# EAGLE design bq25570_board_large (EAGLE 7.2.0)
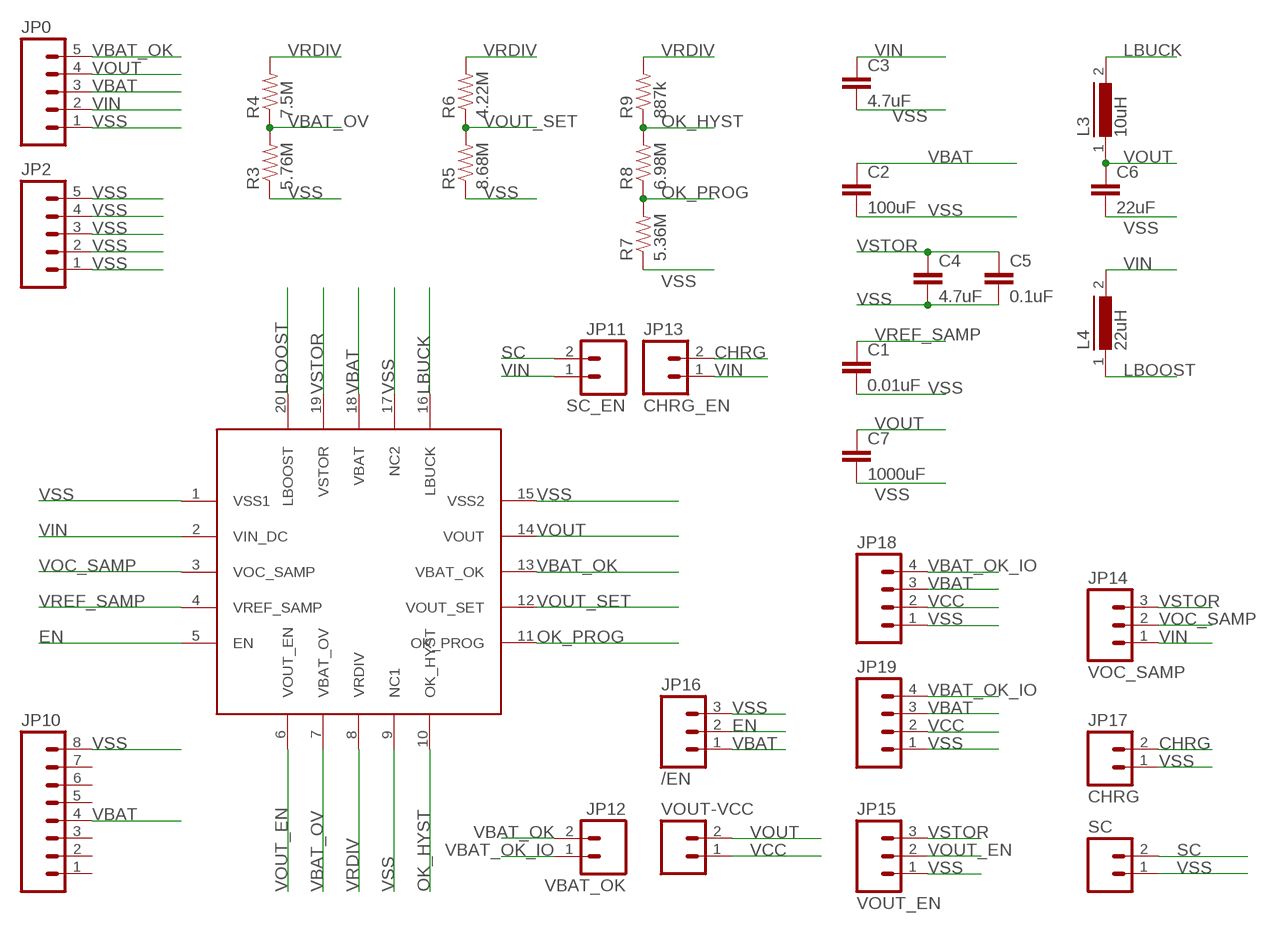
[diagram p0: schematic, sheet 1]

## Parts
C1  0.01uF  CAPEZ  [CAP-PTH-SMALLEZ]
C2  100uF  CAPEZ  [CAP-PTH-SMALLEZ]
C3  4.7uF  CAPEZ  [CAP-PTH-SMALLEZ]
C4  4.7uF  CAPEZ  [CAP-PTH-SMALLEZ]
C5  0.1uF  CAPEZ  [CAP-PTH-SMALLEZ]
C6  22uF  CAPEZ  [CAP-PTH-SMALLEZ]
C7  1000uF  CAPEZ  [CAP-PTH-SMALLEZ]
JP0  M05PTH  [1X05]
JP2  M05PTH  [1X05]
JP10  M08  [1X08_ROUND]
JP11  SC_EN  M02PTH  [1X02]
JP12  VBAT_OK  M02PTH  [1X02]
JP13  CHRG_EN  M02PTH  [1X02]
JP14  VOC_SAMP  M03PTH  [1X03]
JP15  VOUT_EN  M03PTH  [1X03]
JP16  /EN  M03PTH  [1X03]
JP17  CHRG  M02PTH  [1X02]
JP18  M04PTH  [1X04]
JP19  M04PTH  [1X04]
L3  10uH  BC12  [BC12]
L4  22uH  BC12  [BC12]
R3  5.76M  1KOHM-1/4W-1%(PTH)  [AXIAL-0.3]
R4  7.5M  1KOHM-1/4W-1%(PTH)  [AXIAL-0.3]
R5  8.68M  1KOHM-1/4W-1%(PTH)  [AXIAL-0.3]
R6  4.22M  1KOHM-1/4W-1%(PTH)  [AXIAL-0.3]
R7  5.36M  1KOHM-1/4W-1%(PTH)  [AXIAL-0.3]
R8  6.98M  1KOHM-1/4W-1%(PTH)  [AXIAL-0.3]
R9  887k  1KOHM-1/4W-1%(PTH)  [AXIAL-0.3]
SC  M02PTH  [1X02]
SV2  BQ25570_BOARD  [MA05-1]
VOUT-VCC  M02PTH  [1X02]

## Nets
CHRG: JP13.2 JP17.2
EN: JP16.2 SV2.5(EN)
LBOOST: L4.1 SV2.20(LBOOST)
LBUCK: L3.2 SV2.16(LBUCK)
OK_HYST: R8.P$2 R9.P$1 SV2.10(OK_HYST)
OK_PROG: R7.P$2 R8.P$1 SV2.11(OK_PROG)
SC: JP11.2 SC.2
VBAT: C2.1 JP0.3 JP10.4 JP16.1 JP18.3 JP19.3 SV2.18(VBAT)
VBAT_OK: JP0.5 JP12.2 SV2.13(VBAT_OK)
VBAT_OK_IO: JP12.1 JP18.4 JP19.4
VBAT_OV: R3.P$2 R4.P$1 SV2.7(VBAT_OV)
VCC: JP18.2 JP19.2 VOUT-VCC.1
VIN: C3.1 JP0.2 JP11.1 JP13.1 JP14.1 L4.2 SV2.2(VIN_DC)
VOC_SAMP: JP14.2 SV2.3(VOC_SAMP)
VOUT: C6.1 C7.1 JP0.4 L3.1 SV2.14(VOUT) VOUT-VCC.2
VOUT_EN: JP15.2 SV2.6(VOUT_EN)
VOUT_SET: R5.P$2 R6.P$1 SV2.12(VOUT_SET)
VRDIV: R4.P$2 R6.P$2 R9.P$2 SV2.8(VRDIV)
VREF_SAMP: C1.1 SV2.4(VREF_SAMP)
VSS: C1.2 C2.2 C3.2 C4.2 C5.2 C6.2 C7.2 JP0.1 JP2.1 JP2.2 JP2.3 JP2.4 JP2.5 JP10.8 JP15.1 JP16.3 JP17.1 JP18.1 JP19.1 R3.P$1 R5.P$1 R7.P$1 SC.1 SV2.1(VSS1) SV2.9(NC1) SV2.15(VSS2) SV2.17(NC2)
VSTOR: C4.1 C5.1 JP14.3 JP15.3 SV2.19(VSTOR)
Unconnected: JP10.1 JP10.2 JP10.3 JP10.5 JP10.6 JP10.7

## Library data of the parts
C1-C7 = SparkFun-Capacitors:CAP: Capacitor Standard 0603 ceramic capacitor, and 0.1" leaded capacitor.
JP0 JP2 = SparkFun-Connectors:M05: Header 5 Standard 5-pin 0.1" header. Use with straight break away headers (SKU : PRT-00116), right angle break away headers (PRT-00553), swiss pins (PRT-00743), machine pins (PRT-00117), and female headers (PRT-00115). Molex polarized connector foot print use with SKU : PRT-08230 with associated crimp pins and housings.
JP10 = SparkFun-Connectors:M08: Header 8 Standard 8-pin 0.1" header. Use with straight break away headers (SKU : PRT-00116), right angle break away headers (PRT-00553), swiss pins (PRT-00743), machine pins (PRT-00117), and female headers (PRT-00115).
JP11-JP13 JP17 SC VOUT-VCC = SparkFun-Connectors:M02: Standard 2-pin 0.1" header. Use with - straight break away headers ( PRT-00116) - right angle break away headers (PRT-00553) - swiss pins (PRT-00743) - machine pins (PRT-00117) - female headers (PRT-00115) Molex polarized connector foot print use with: PRT-08233 with associated crimp pins and housings. 2.54_SCREWTERM for use with PRT-10571. 3.5mm Screw Terminal footprints for PRT-08084 5mm Screw Terminal footprints for use with PRT-08432
JP14-JP16 = SparkFun-Connectors:M03: Header 3 Standard 3-pin 0.1" header. Use with straight break away headers (SKU : PRT-00116), right angle break away headers (PRT-00553), swiss pins (PRT-00743), machine pins (PRT-00117), and female headers (PRT-00115). Molex polarized connector foot print use with SKU : PRT-08232 with associated crimp pins and housings.
JP18 JP19 = SparkFun-Connectors:M04: Header 4 Standard 4-pin 0.1" header. Use with straight break away headers (SKU : PRT-00116), right angle break away headers (PRT-00553), swiss pins (PRT-00743), machine pins (PRT-00117), and female headers (PRT-00115). Molex polarized connector foot print use with SKU : PRT-08231 with associated crimp pins and housings. 1MM SMD Version SKU: PRT-10208
L3 L4 = inductors:BC12: INDUCTOR
R3-R9 = SparkFun-Resistors:1KOHM-1/4W-1%(PTH): RES-12182; PROD_ID: RES-12182; VALUE: 1K
SV2 = bq25570_board:BQ25570_BOARD: PIN HEADER; OC_FARNELL: unknown; OC_NEWARK: unknown

## Board
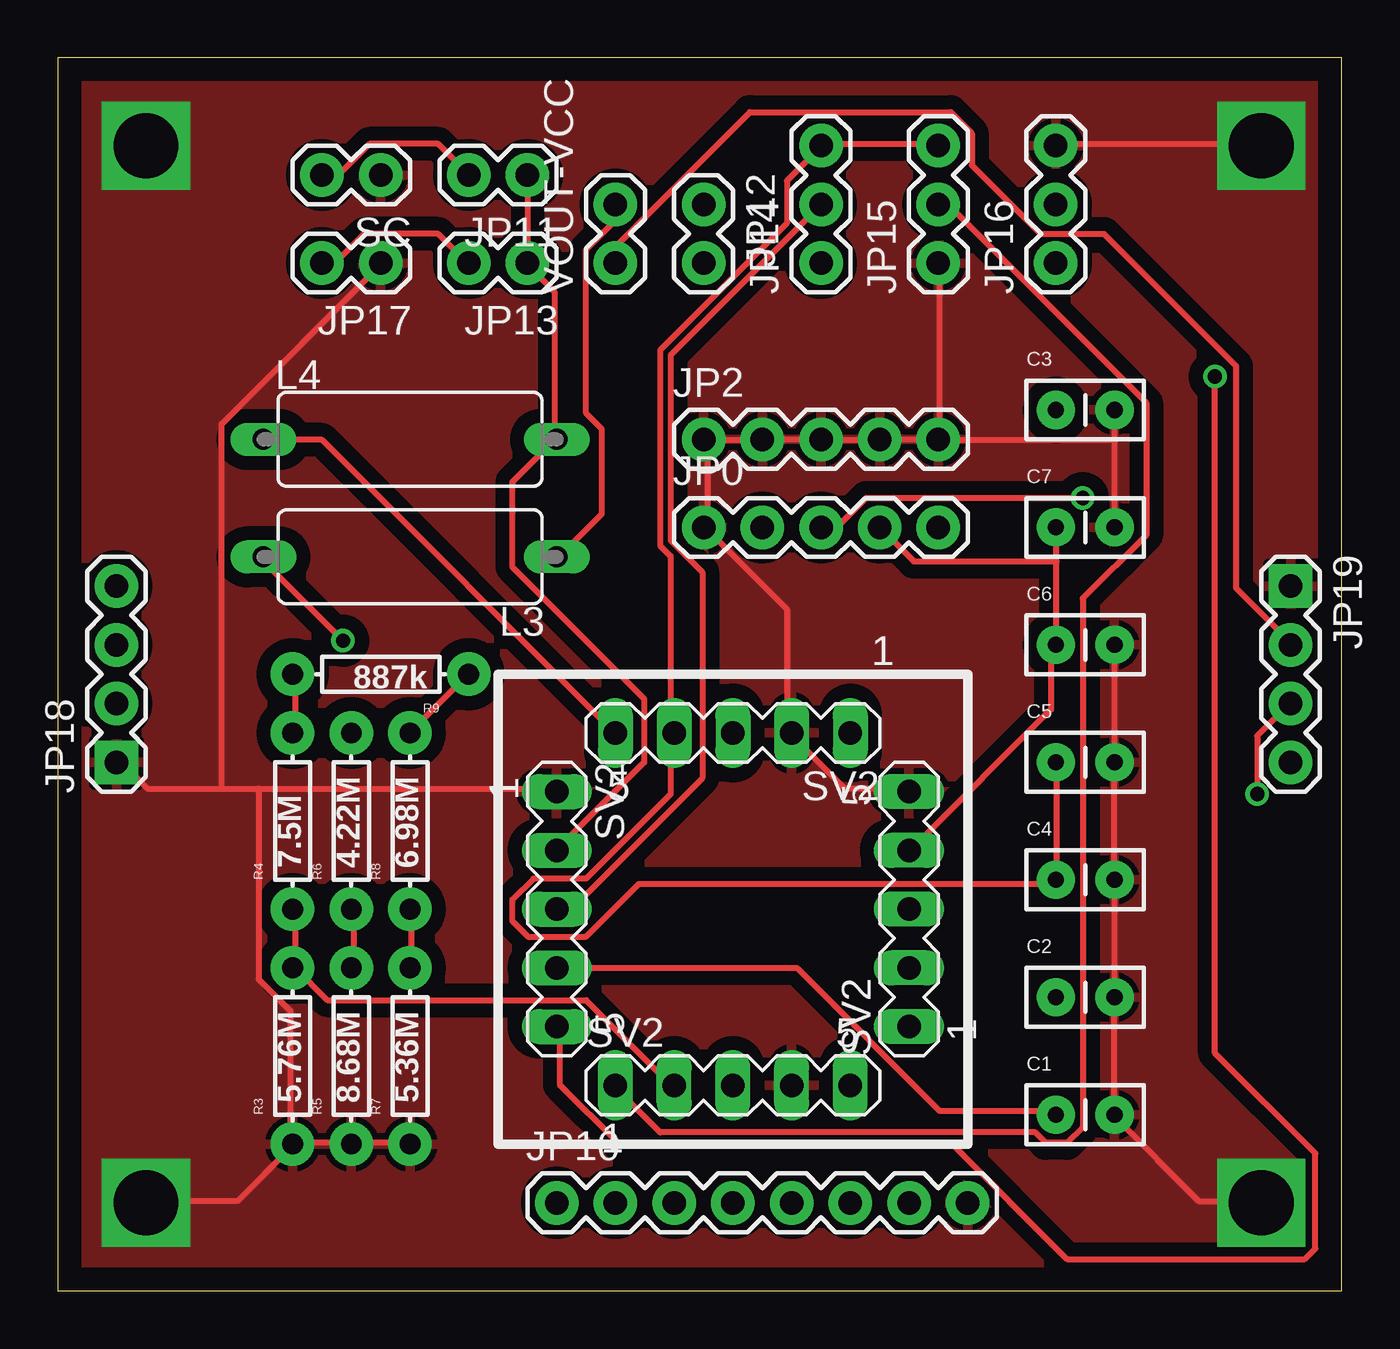
[diagram p1: board, top side]
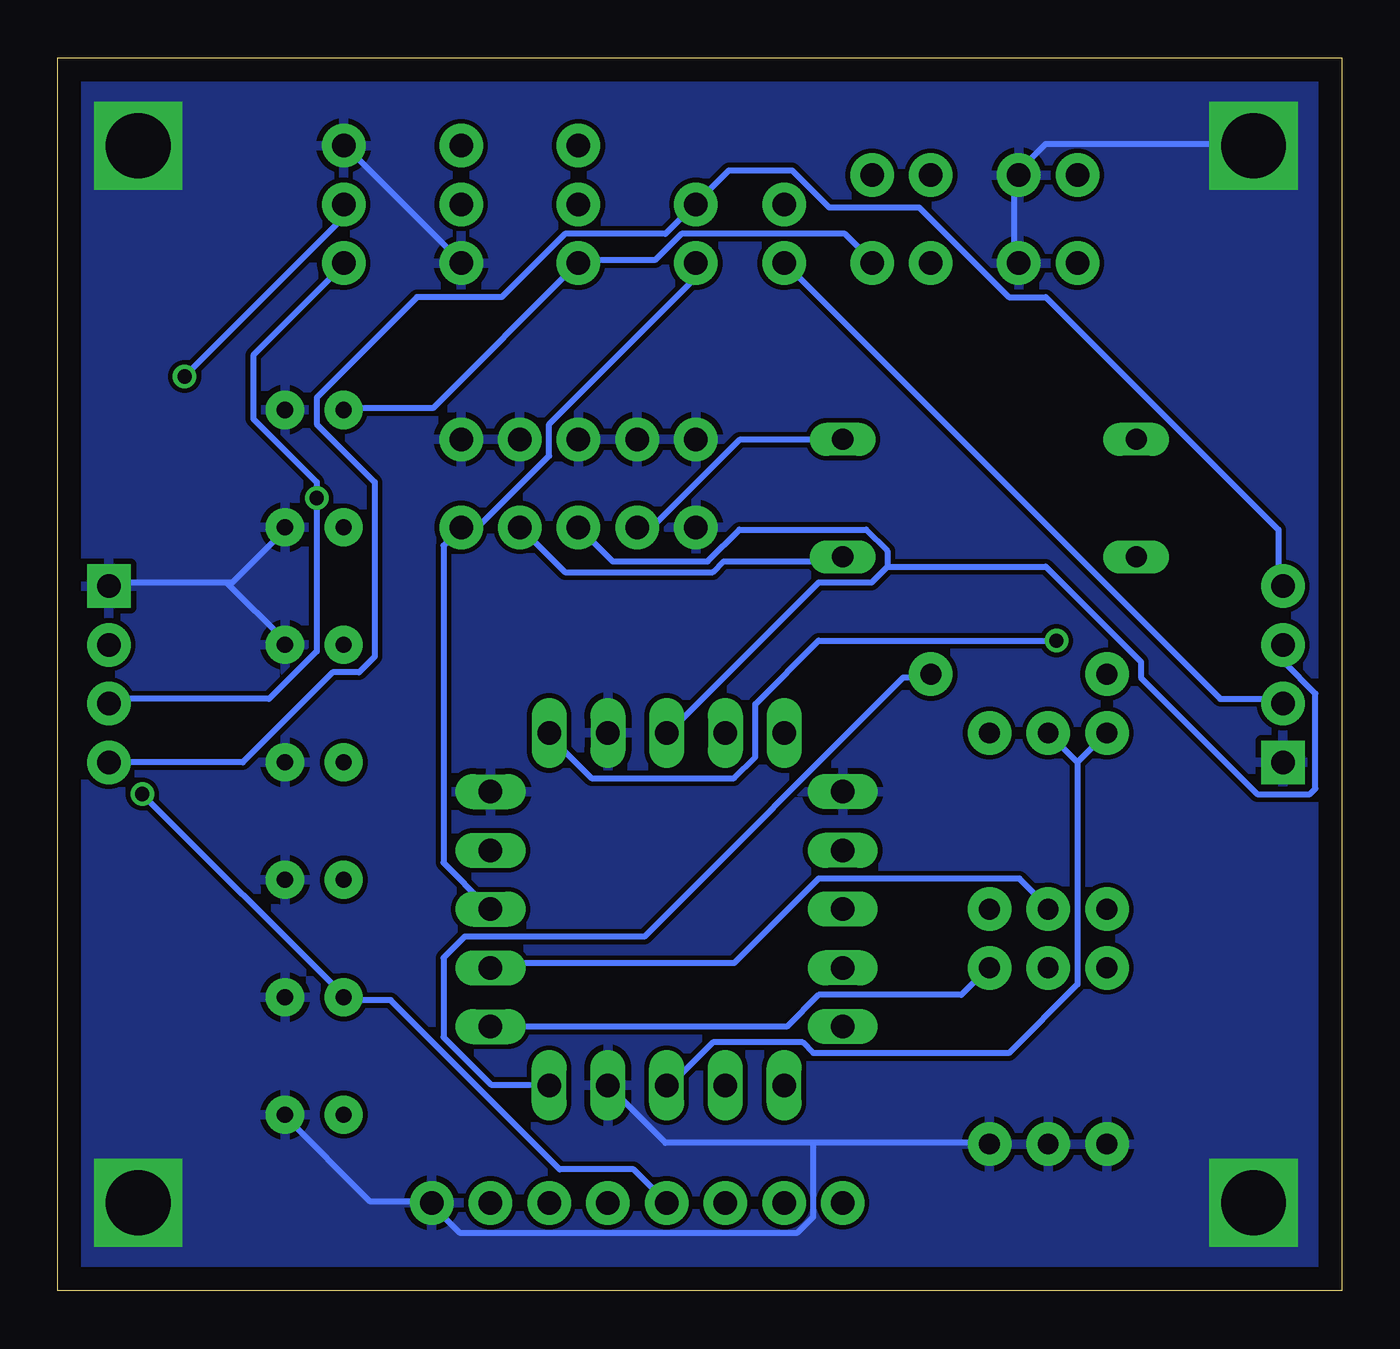
[diagram p2: board, bottom side, seen from below]

Size 55.55 x 53.33 mm. Coordinates in mm from the lower left corner, seen from the top.
Outline: 0,0 55.55,0 55.55,53.33 0,53.33 0,0
Copper layers (1*16): Top 0.035mm / dielectric 1.5mm / Bottom 0.035mm
Design rules "default": minimum track width 10mil, minimum drill 24mil, track to track 8mil, track to pad 8mil, pad to pad 8mil, via to via 8mil, smd to smd 8mil, copper to edge 40mil, drill to drill 8mil, minimum pad ring 10mil, minimum via ring 8mil, stop-mask expansion 4mil, vias tented up to drill 0mil, thermal gap 10mil

### Footprints (pad centres in the part's own frame; a part is rotated, then mirrored left to right if it is on the bottom)
CAP-PTH-SMALLEZ = drill 0.7 pad 1.651: 1 0,0; 2 2.54,0
1X05 = drill 1.016 pad 1.88: 1 0,0; 2 2.54,0; 3 5.08,0; 4 7.62,0; 5 10.16,0
1X08_ROUND = drill 1.016 pad 1.88: 1 0,0; 2 2.54,0; 3 5.08,0; 4 7.62,0; 5 10.16,0; 6 12.7,0; 7 15.24,0; 8 17.78,0
1X02 = drill 1.016 pad 1.88: 1 0,0; 2 2.54,0
1X03 = drill 1.016 pad 1.88: 1 0,0; 2 2.54,0; 3 5.08,0
1X04 = drill 1.016 pad 1.88 square: 1 0,0 | drill 1.016 pad 1.88: 2 2.54,0; 3 5.08,0; 4 7.62,0
BC12 = drill 0.914 long: 1 -6.35,0; 2 6.35,0
AXIAL-0.3 = drill 0.9 pad 1.88: P$1 -3.81,0; P$2 3.81,0
MA05-1 = drill 1.016 long: 1 -7.62,5.08; 2 -7.62,2.54; 3 -7.62,0; 4 -7.62,-2.54; 5 -7.62,-5.08; 6 -5.08,-7.62; 7 -2.54,-7.62; 8 0,-7.62; 9 2.54,-7.62; 10 5.08,-7.62; 11 7.62,-5.08; 12 7.62,-2.54; 13 7.62,0; 14 7.62,2.54; 15 7.62,5.08; 16 5.08,7.62; 17 2.54,7.62; 18 0,7.62; 19 -2.54,7.62; 20 -5.08,7.62

### Placement (x,y rotation side)
C1  43.18,7.62 0 top
C2  43.18,12.7 0 top
C3  43.18,38.1 0 top
C4  43.18,17.78 0 top
C5  43.18,22.86 0 top
C6  43.18,27.94 0 top
C7  43.18,33.02 0 top
JP0  27.94,33.02 0 top
JP2  27.94,36.83 0 top
JP10  21.59,3.81 0 top
JP11  20.32,48.26 180 top
JP12  27.94,46.99 270 top
JP13  20.32,44.45 180 top
JP14  33.02,44.45 90 top
JP15  38.1,44.45 90 top
JP16  43.18,44.45 90 top
JP17  13.97,44.45 180 top
JP18  2.54,22.86 90 top
JP19  53.34,30.48 270 top
L3  15.24,31.75 180 top
L4  15.24,36.83 0 top
R3  10.16,10.16 90 top
R4  10.16,20.32 90 top
R5  12.7,10.16 90 top
R6  12.7,20.32 90 top
R7  15.24,10.16 90 top
R8  15.24,20.32 90 top
R9  13.97,26.67 180 top
SC  13.97,48.26 180 top
SV2  29.21,16.51 0 top
VOUT-VCC  24.13,44.45 90 top

### Tracks (layer width: path | path; a pad name or v marks a point on that pad's centre or on a via)
CHRG
  Top 0.254: JP17.2 11.43,44.58 12.12,44.58 13.26,45.72 16.46,45.72 17.6,44.58 JP13.2
EN  (via drill 0.61)
  Top 0.254: SV2.5 21.72,11.43 21.72,8.91 24.23,6.4 38.63,6.4 43.66,1.37 53.95,1.37 54.41,1.83 54.41,5.94 50.06,10.29 v50.06,39.55
  Bottom 0.254: v50.06,39.55 43.2,46.41 43.2,46.86 JP16.2
LBOOST
  Top 0.254: L4.1 8.91,36.8 11.43,36.8 24,24.23 SV2.20
LBUCK  (via drill 0.61)
  Top 0.254: v12.34,28.12 8.91,31.55 L3.2
  Bottom 0.254: v12.34,28.12 22.63,28.12 25.38,25.38 25.38,23.09 26.29,22.17 32.46,22.17 34.29,24 SV2.16
OK_HYST
  Top 0.254: R8.P$2 15.32,24.23 17.6,26.52 R9.P$1
  Bottom 0.254: SV2.10 34.29,8.91 36.8,8.91 38.86,10.97 38.86,14.4 37.95,15.32 30.18,15.32 18.97,26.52 17.83,26.52 R9.P$1
OK_PROG
  Top 0.254: R8.P$1 15.32,16.46 15.32,14.17 R7.P$2
  Bottom 0.254: SV2.11 24,11.43 22.63,12.8 16.46,12.8 15.32,13.95 R7.P$2
SC
  Top 0.254: SC.2 11.43,48.46 12.34,48.46 13.49,49.61 16.46,49.61 17.6,48.46 JP11.2
VBAT  (via drill 0.61)
  Top 0.254: v51.89,21.49 51.89,24 53.26,25.38 JP19.3 | v44.35,34.29 34.98,34.29 33.83,33.15 33.15,33.15 JP0.3
  Bottom 0.254: 19.66,31.32 20.34,30.63 22.63,30.63 29.03,24.23 SV2.18 | 19.66,31.32 19.66,32 20.57,32.92 26.06,32.92 27.43,31.55 31.55,31.55 JP0.3 | 19.66,31.32 12.8,31.32 8.69,27.2 8.69,26.52 3.66,21.49 1.37,21.49 1.14,21.72 1.14,25.83 2.52,27.2 2.52,27.89 JP18.3 | JP10.4 29.26,3.89 30.63,5.26 33.83,5.26 41.15,12.57 42.98,12.57 C2.1 43.2,12.8 v51.89,21.49 | JP19.3 53.26,25.6 46.41,25.6 44.35,27.66 v44.35,34.29 44.35,34.98 47.09,37.72 47.09,40.46 43.2,44.35 JP16.1
VBAT_OK
  Bottom 0.254: SV2.13 37.03,16.69 38.86,18.52 38.86,32.23 38.18,32.92 JP0.5 37.95,33.15 37.26,33.15 34.29,36.12 34.29,37.49 28.12,43.66 28.12,44.35 JP12.2
VBAT_OK_IO
  Bottom 0.254: JP18.4 2.74,30.63 2.74,32.92 12.8,42.98 14.4,42.98 18.29,46.86 22.17,46.86 23.77,48.46 26.52,48.46 27.89,47.09 JP12.1 28.12,46.86 29.26,45.72 33.6,45.72 36.35,42.98 40.01,42.98 44.35,38.63 44.35,37.49 41.83,34.98 41.83,27.43 42.52,26.75 43.66,26.75 47.55,22.86 JP19.4
VBAT_OV
  Top 0.254: SV2.7 26.52,8.91 22.86,12.57 11.66,12.57 10.29,13.95 R3.P$2 10.29,14.17 10.29,16.46 R4.P$1
VCC
  Top 0.254: JP19.2 53.26,28.12 50.98,30.4 50.98,40.01 45.26,45.72 42.52,45.72 39.55,48.69 39.55,50.06 38.63,50.98 29.95,50.98 24.23,45.26 24.23,44.58 VOUT-VCC.1
  Bottom 0.254: JP18.2 2.74,25.6 5.26,25.6 24,44.35 VOUT-VCC.1
VIN
  Top 0.254: SV2.2 21.72,19.2 25.38,22.86 25.38,25.6 19.66,31.32 19.66,34.98 21.49,36.8 L4.2 21.49,37.03 21.49,43.2 20.34,44.35 JP13.1 20.34,44.58 20.34,48.23 JP11.1
  Bottom 0.254: C3.1 42.98,38.18 39.32,38.18 33.15,44.35 JP14.1 32.92,44.58 29.72,44.58 28.57,45.72 21.49,45.72 20.34,44.58 JP13.1 | JP0.2 30.4,33.15 29.72,33.15 26.06,36.8 21.72,36.8 L4.2
VOC_SAMP
  Top 0.254: SV2.3 21.72,16.69 22.4,16.69 27.89,22.17 27.89,31.09 26.52,32.46 26.52,40.46 32.92,46.86 JP14.2
VOUT
  Top 0.254: SV2.14 37.03,19.2 42.98,25.15 42.98,27.89 C6.1 43.2,28.12 43.2,31.55 | 43.2,31.55 43.2,32.92 C7.1 | VOUT-VCC.2 24,46.86 24,46.18 22.86,45.03 22.86,37.95 23.55,37.26 23.55,33.6 21.72,31.77 L3.1 | 43.2,31.55 37.03,31.55 JP0.4
  Bottom 0.254: L3.1 21.72,31.55 26.75,31.55 27.2,31.09 33.6,31.09 35.43,32.92 JP0.4
VOUT_EN
  Top 0.254: SV2.6 24.23,8.69 26.06,6.86 42.29,6.86 42.75,6.4 43.66,6.4 44.35,7.09 44.35,29.95 47.09,32.69 47.09,38.41 38.63,46.86 38.18,46.86 JP15.2
VOUT_SET
  Top 0.254: R5.P$2 12.8,14.17 12.8,16.46 R6.P$1
  Bottom 0.254: SV2.12 36.8,14.17 26.29,14.17 22.63,17.83 13.95,17.83 12.8,16.69 R6.P$1
VRDIV
  Top 0.254: R9.P$2 10.29,26.52 10.29,24.23 R4.P$2
  Bottom 0.254: 11.43,22.86 11.43,13.26 14.4,10.29 22.86,10.29 23.32,10.74 27.2,10.74 29.03,8.91 SV2.8 | R4.P$2 11.43,22.86 | 11.43,22.86 R6.P$2
VREF_SAMP
  Top 0.254: SV2.4 21.72,13.95 32,13.95 38.18,7.77 42.98,7.77 C1.1
VSS  (via drill 2.8)
  Top 0.254: 3.89,49.61 v3.81,49.53 3.66,49.38 | 5.26,3.89 3.89,3.89 v3.81,3.81 5.26,3.89 | 5.26,3.89 7.77,3.89 10.06,6.17 R3.P$1 | R7.P$1 15.09,6.4 12.8,6.4 R5.P$1 12.57,6.4 10.29,6.4 R3.P$1 | 7.09,21.72 3.89,21.72 2.74,22.86 JP18.1 | 7.09,21.72 8.69,21.72 | 8.69,21.72 21.49,21.72 SV2.1 | 7.09,21.72 7.09,37.49 13.95,44.35 JP17.1 | 8.69,21.72 8.69,13.49 10.06,12.12 10.06,6.4 R3.P$1 | C6.2 C5.2 C4.2 C2.2 C1.2 45.72,7.54 49.38,3.89 51.89,3.89 v52.07,3.81 | C3.2 45.72,36.8 | 45.72,36.8 C7.2 | v52.07,49.53 51.89,49.61 43.2,49.61 JP16.3 | SV2.15 36.8,21.72 34.06,21.72 31.77,24 SV2.17 31.55,24.23 31.55,29.49 28.12,32.92 JP0.1 28.12,33.15 28.12,36.8 | JP2.5 37.95,36.8 35.66,36.8 JP2.4 35.43,36.8 33.15,36.8 JP2.3 32.92,36.8 30.63,36.8 JP2.2 30.4,36.8 28.12,36.8 | 28.12,36.8 JP2.1 | JP15.1 38.18,44.35 38.18,37.03 JP2.5 | 45.72,36.8 38.18,36.8 JP2.5
  Bottom 0.254: SV2.9 29.26,6.4 22.86,6.4 | 22.86,6.4 15.32,6.4 R7.P$1 | v3.81,49.53 3.89,49.61 12.8,49.61 13.95,48.46 SC.1 14.17,48.23 14.17,44.58 JP17.1 | 48.23,30.63 48.01,30.63 45.72,32.92 C7.2 | 48.23,30.63 53.26,30.63 JP19.1 | 48.23,30.63 45.72,28.12 C6.2 | C1.2 45.72,7.54 42.06,3.89 39.55,3.89 JP10.8 39.32,3.66 38.18,2.52 23.55,2.52 22.86,3.2 22.86,6.4 | JP15.1 38.18,44.58 42.98,49.38 JP16.3
  pour Top (isolate 0.61): -6.35,-7.62 71.12,-12.7 71.12,73.66 -6.35,53.34
  pour Bottom: -11.43,58.42 -12.7,-5.08 64.77,-8.89 63.5,55.88
VSTOR
  Top 0.254: C5.1 43.2,22.86 43.2,17.83 C4.1 42.98,17.6 25.15,17.6 22.86,15.32 20.34,15.32 19.66,16 19.66,16.92 20.57,17.83 22.86,17.83 26.52,21.49 26.52,24 SV2.19 26.52,24.23 26.52,31.77 26.06,32.23 26.06,40.69 31.55,46.18 31.55,48.01 32.92,49.38 JP14.3 33.15,49.61 37.95,49.61 JP15.3